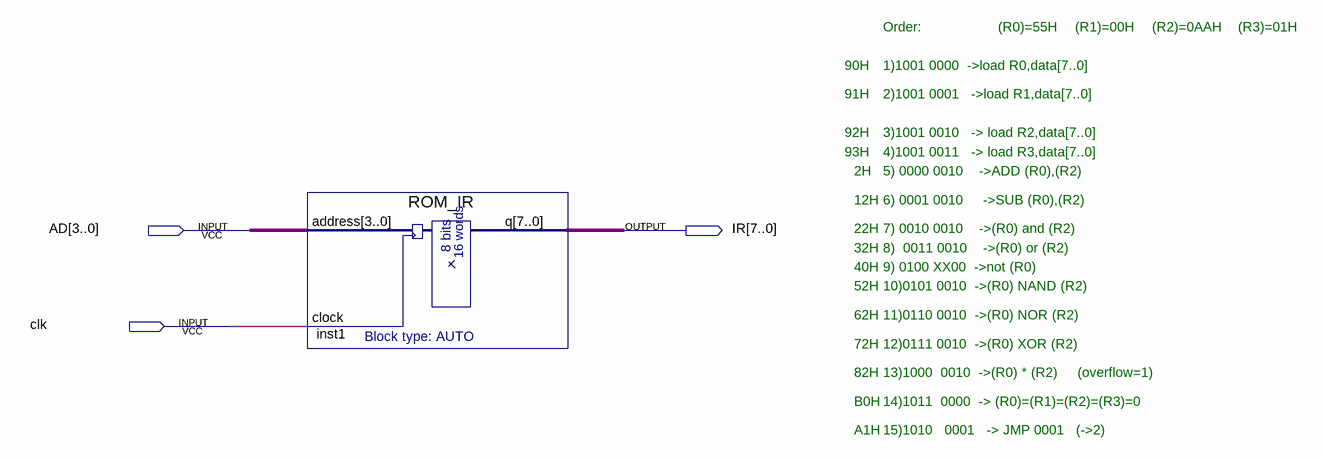
[diagram p0: schematic sheet]
// Quartus schematic ROM_IR_8bit.bdf as structural Verilog: 1 symbols, 3 pins
module ROM_IR_8bit (
  input  [3:0] AD,
  input  clk,
  output [7:0] IR
);

  ROM_IR inst1 (.address(AD), .clock(clk), .q(IR));

  // Notes on the sheet:
  //   Order:
  //   (R0)=55H
  //   (R1)=00H
  //   (R2)=0AAH
  //   (R3)=01H
  //   90H
  //   1)1001 0000  ->load R0,data[7..0]
  //   91H
  //   2)1001 0001   ->load R1,data[7..0]
  //   92H
  //   3)1001 0010   -> load R2,data[7..0]
  //   93H
  //   4)1001 0011   -> load R3,data[7..0]
  //   2H
  //   5) 0000 0010    ->ADD (R0),(R2)
  //   12H
  //   6) 0001 0010     ->SUB (R0),(R2)
  //   22H
  //   7) 0010 0010    ->(R0) and (R2)
  //   32H
  //   8)  0011 0010    ->(R0) or (R2)
  //   40H
  //   9) 0100 XX00  ->not (R0)
  //   52H
  //   10)0101 0010  ->(R0) NAND (R2)
  //   62H
  //   11)0110 0010  ->(R0) NOR (R2)
  //   72H
  //   12)0111 0010  ->(R0) XOR (R2)
  //   82H
  //   13)1000  0010  ->(R0) * (R2)     (overflow=1)
  //   B0H
  //   14)1011  0000  -> (R0)=(R1)=(R2)=(R3)=0
  //   A1H
  //   15)1010   0001   -> JMP 0001   (->2)
endmodule
